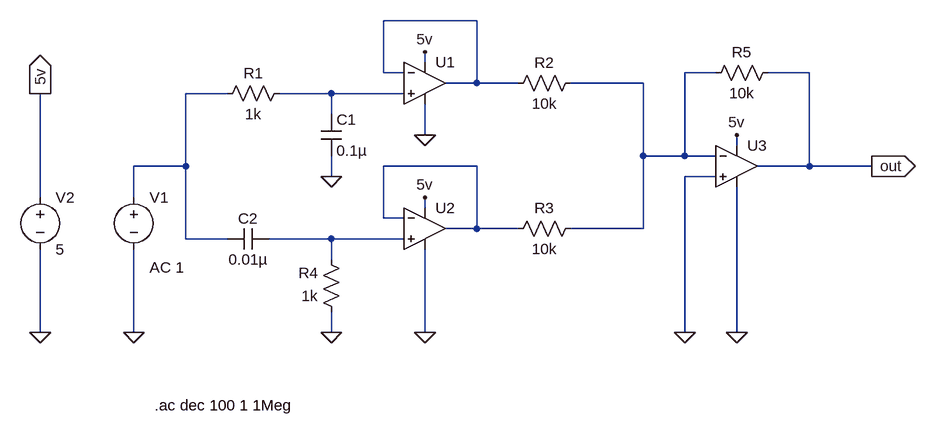
[diagram p0: schematic rechazabanda.asc]
rechazabanda.asc, the LTspice schematic file:
Version 4
SHEET 1 960 680
WIRE 256 -16 112 -16
WIRE 176 48 176 32
WIRE 112 64 112 -16
WIRE 144 64 112 64
WIRE 624 64 576 64
WIRE 768 64 704 64
WIRE 256 80 256 -16
WIRE 256 80 208 80
WIRE 320 80 256 80
WIRE 512 80 400 80
WIRE -128 96 -192 96
WIRE 32 96 -48 96
WIRE 144 96 32 96
WIRE 32 128 32 96
WIRE 176 160 176 112
WIRE 656 176 656 160
WIRE 512 192 512 80
WIRE 576 192 576 64
WIRE 576 192 512 192
WIRE 624 192 576 192
WIRE -192 208 -192 96
WIRE -192 208 -272 208
WIRE 256 208 112 208
WIRE 768 208 768 64
WIRE 768 208 688 208
WIRE 864 208 768 208
WIRE 32 224 32 192
WIRE 624 224 576 224
WIRE -416 256 -416 96
WIRE -272 256 -272 208
WIRE 176 272 176 256
WIRE 112 288 112 208
WIRE 144 288 112 288
WIRE 256 304 256 208
WIRE 256 304 208 304
WIRE 320 304 256 304
WIRE 512 304 512 192
WIRE 512 304 400 304
WIRE -192 320 -192 208
WIRE -128 320 -192 320
WIRE 32 320 -64 320
WIRE 144 320 32 320
WIRE 32 352 32 320
WIRE -416 464 -416 336
WIRE -272 464 -272 336
WIRE 32 464 32 432
WIRE 176 464 176 336
WIRE 576 464 576 224
WIRE 656 464 656 240
FLAG 32 224 0
FLAG 32 464 0
FLAG -272 464 0
FLAG 576 464 0
FLAG 656 464 0
FLAG 176 160 0
FLAG 176 464 0
FLAG -416 464 0
FLAG -416 96 5v
IOPIN -416 96 Out
FLAG 176 32 5v
FLAG 176 256 5v
FLAG 656 160 5v
FLAG 864 208 out
IOPIN 864 208 Out
SYMBOL OpAmps\\UniversalOpAmp 176 80 R0
SYMATTR InstName U1
SYMBOL OpAmps\\UniversalOpAmp 176 304 R0
SYMATTR InstName U2
SYMBOL res -32 80 R90
WINDOW 0 0 56 VBottom 2
WINDOW 3 32 56 VTop 2
SYMATTR InstName R1
SYMATTR Value 1k
SYMBOL res 416 64 R90
WINDOW 0 0 56 VBottom 2
WINDOW 3 32 56 VTop 2
SYMATTR InstName R2
SYMATTR Value 10k
SYMBOL res 416 288 R90
WINDOW 0 0 56 VBottom 2
WINDOW 3 32 56 VTop 2
SYMATTR InstName R3
SYMATTR Value 10k
SYMBOL res 48 448 R180
WINDOW 0 36 76 Left 2
WINDOW 3 36 40 Left 2
SYMATTR InstName R4
SYMATTR Value 1k
SYMBOL cap 16 128 R0
SYMATTR InstName C1
SYMATTR Value 0.1µ
SYMBOL cap -64 304 R90
WINDOW 0 0 32 VBottom 2
WINDOW 3 32 32 VTop 2
SYMATTR InstName C2
SYMATTR Value 0.01µ
SYMBOL voltage -272 240 R0
WINDOW 123 24 124 Left 2
WINDOW 39 0 0 Left 0
SYMATTR Value2 AC 1
SYMATTR InstName V1
SYMATTR Value ""
SYMBOL OpAmps\\UniversalOpAmp 656 208 R0
SYMATTR InstName U3
SYMBOL res 720 48 R90
WINDOW 0 0 56 VBottom 2
WINDOW 3 32 56 VTop 2
SYMATTR InstName R5
SYMATTR Value 10k
SYMBOL voltage -416 240 R0
WINDOW 123 0 0 Left 0
WINDOW 39 0 0 Left 0
SYMATTR InstName V2
SYMATTR Value 5
TEXT -240 576 Left 2 !.ac dec 100 1 1Meg

The netlist it stands for:
* rechazabanda.asc
XU1 N004 N001 5v 0 N001 level1 Avol=1Meg GBW=10Meg Vos=0 En=0 Enk=0 In=0 Ink=0 Rin=500Meg  ; pins In+ In- V+ V- OUT
XU2 N006 N005 5v 0 N005 level1 Avol=1Meg GBW=10Meg Vos=0 En=0 Enk=0 In=0 Ink=0 Rin=500Meg  ; pins In+ In- V+ V- OUT
R1 N004 N003 1k
R2 N002 N001 10k
R3 N002 N005 10k
R4 0 N006 1k
C1 N004 0 0.1µ
C2 N006 N003 0.01µ
V1 N003 0 AC 1
XU3 0 N002 5v 0 out level1 Avol=1Meg GBW=10Meg Vos=0 En=0 Enk=0 In=0 Ink=0 Rin=500Meg  ; pins In+ In- V+ V- OUT
R5 out N002 10k
V2 5v 0 5
.ac dec 100 1 1Meg
.lib UniversalOpAmp1.lib
.backanno
.end